# EAGLE design picoamp (EAGLE 5.12)
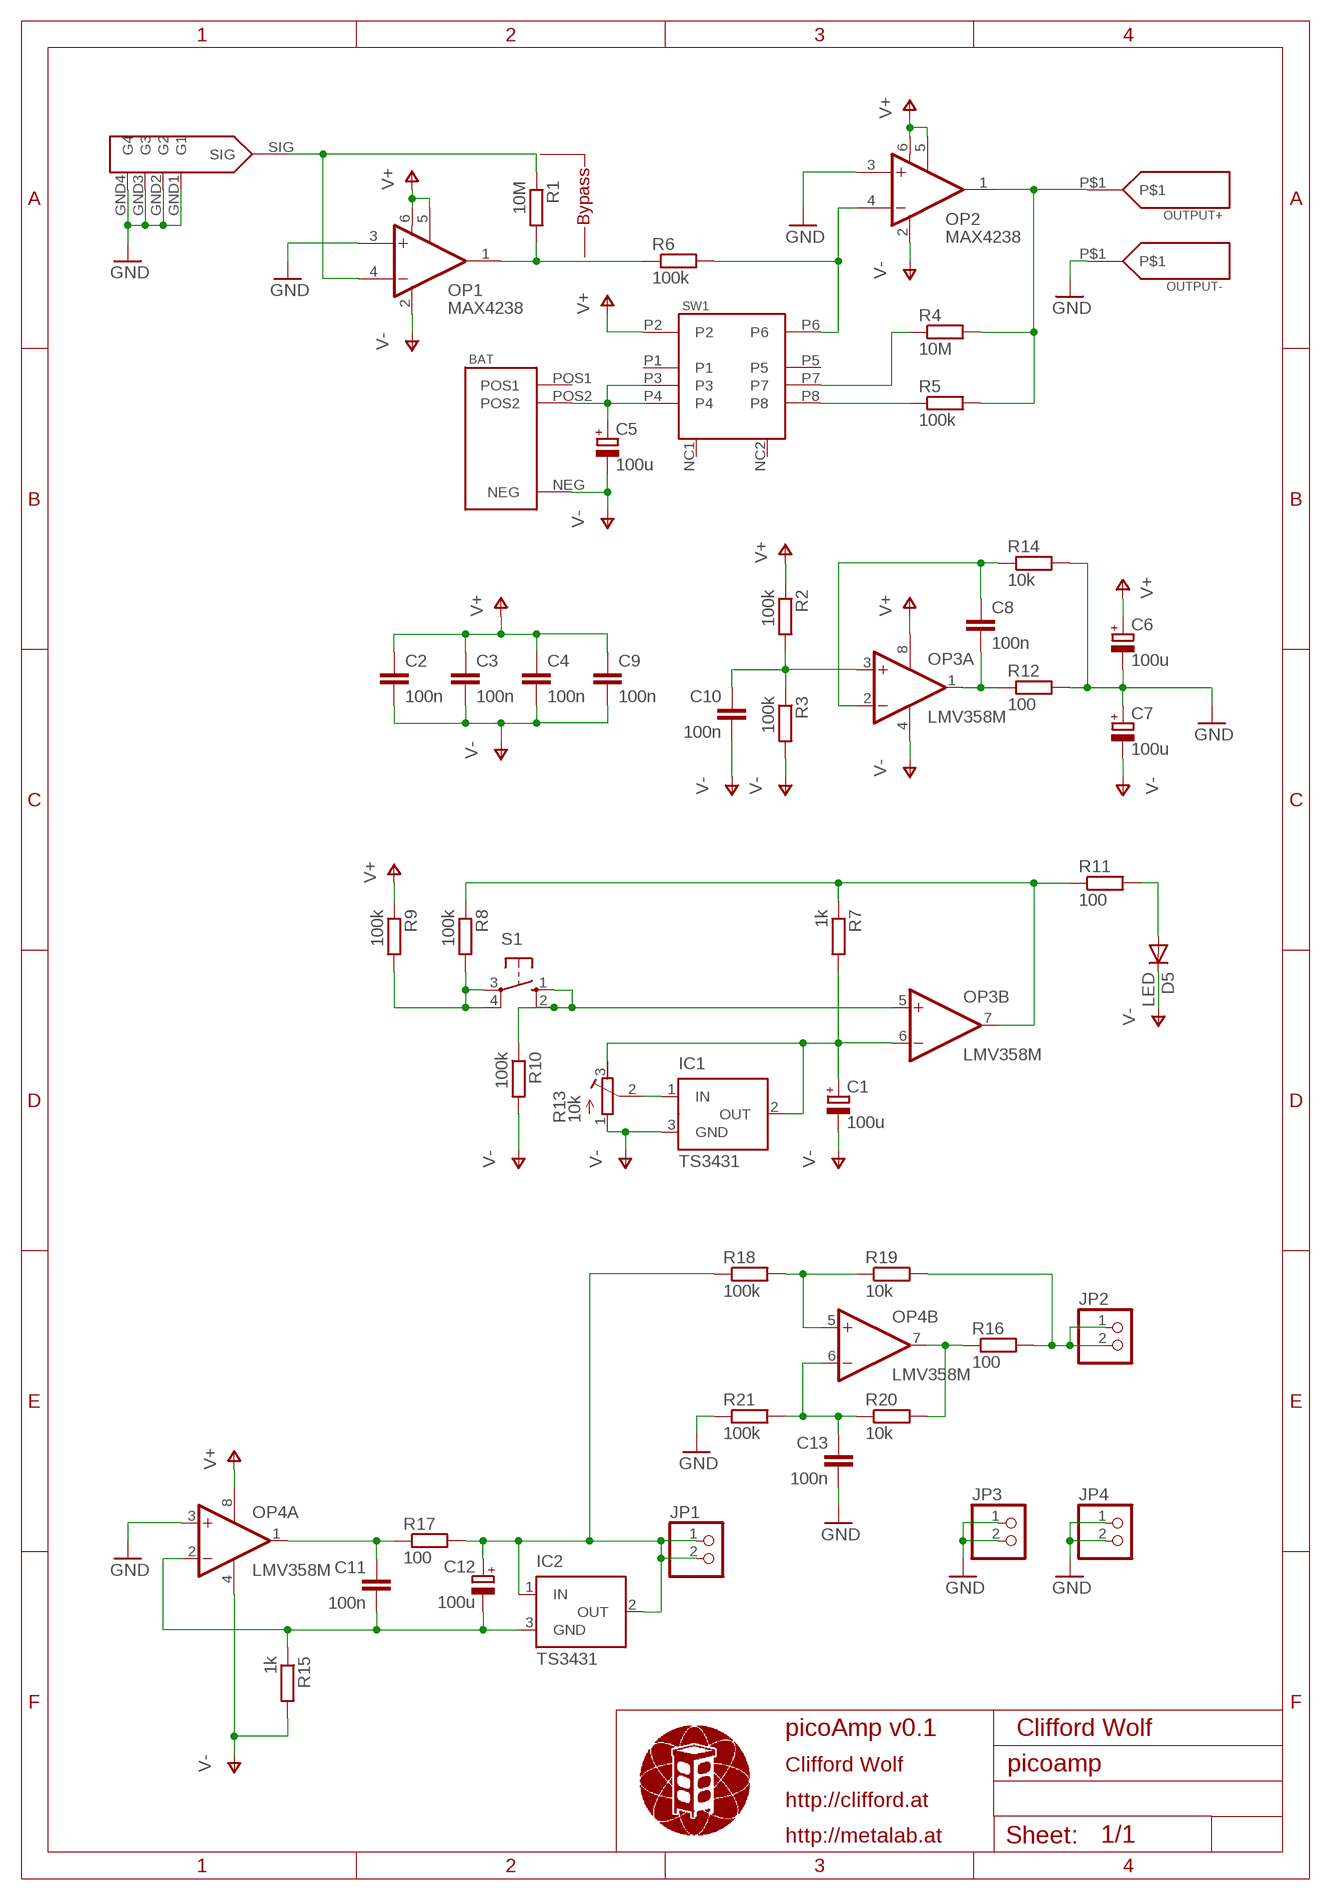
[diagram p0: schematic, sheet 1]

## Parts
BAT  BATCLIP  [BATCLIP]
C1  100u  CPOL-EUA/3216-18R  [A/3216-18R]
C2  100n  C-EUC1206  [C1206]
C3  100n  C-EUC1206  [C1206]
C4  100n  C-EUC1206  [C1206]
C5  100u  CPOL-EUA/3216-18R  [A/3216-18R]
C6  100u  CPOL-EUA/3216-18R  [A/3216-18R]
C7  100u  CPOL-EUA/3216-18R  [A/3216-18R]
C8  100n  C-EUC1206  [C1206]
C9  100n  C-EUC1206  [C1206]
C10  100n  C-EUC1206  [C1206]
C11  100n  C-EUC1206  [C1206]
C12  100u  CPOL-EUA/3216-18R  [A/3216-18R]
C13  100n  C-EUC1206  [C1206]
D5  LED  DIODE-SOD323-W  [SOD323-W]
IC1  TS3431  MAX6520  [SOT23]
IC2  TS3431  MAX6520  [SOT23]
INPUT  BNC  [BNC]
JP1  PINHD-1X2  [1X02]
JP2  PINHD-1X2  [1X02]
JP3  PINHD-1X2  [1X02]
JP4  PINHD-1X2  [1X02]
OP1  MAX4238  [SOT23-6]
OP2  MAX4238  [SOT23-6]
OP3  LMV358M  [SO08]
OP4  LMV358M  [SO08]
OUTPUT+  BANANA  [BANANA]
OUTPUT-  BANANA  [BANANA]
R1  10M  R-EU_R1206W  [R1206W]
R2  100k  R-EU_R1206W  [R1206W]
R3  100k  R-EU_R1206W  [R1206W]
R4  10M  R-EU_R1206W  [R1206W]
R5  100k  R-EU_R1206W  [R1206W]
R6  100k  R-EU_R1206W  [R1206W]
R7  1k  R-EU_R1206W  [R1206W]
R8  100k  R-EU_R1206W  [R1206W]
R9  100k  R-EU_R1206W  [R1206W]
R10  100k  R-EU_R1206W  [R1206W]
R11  100  R-EU_R1206W  [R1206W]
R12  100  R-EU_R1206W  [R1206W]
R13  10k  R-TRIMM3314J  [RTRIM3314J]
R14  10k  R-EU_R1206W  [R1206W]
R15  1k  R-EU_R1206W  [R1206W]
R16  100  R-EU_R1206W  [R1206W]
R17  100  R-EU_R1206W  [R1206W]
R18  100k  R-EU_R1206W  [R1206W]
R19  10k  R-EU_R1206W  [R1206W]
R20  10k  R-EU_R1206W  [R1206W]
R21  100k  R-EU_R1206W  [R1206W]
S1  10-XX  [B3F-10XX]
SW1  SW-2P3T  [SW-2P3T]

## Nets
ASDASD: INPUT.SIG OP1.4(-IN) R1.1
GND: C6.- C7.+ C13.2 INPUT.GND1(G1) INPUT.GND2(G2) INPUT.GND3(G3) INPUT.GND4(G4) JP3.1 JP3.2 JP4.1 JP4.2 OP1.3(+IN) OP2.3(+IN) OP4.3(A:+IN) OUTPUT-.P$1 R12.2 R14.2 R21.1
N$1: OP1.1(OUT) R1.2 R6.1
N$2: C8.1 OP3.2(A:-IN) R14.1
N$3: C10.1 OP3.3(A:+IN) R2.2 R3.1
N$4: BAT.POS2 C5.+ SW1.P3 SW1.P4
N$5: C12.+ IC2.1(IN) IC2.2(OUT) JP1.1 JP1.2 R17.2 R18.1
N$6: R5.1 SW1.P8
N$7: R4.1 SW1.P7
N$8: R8.2 R9.2 S1.3(P) S1.4(P1)
N$9: OP2.4(-IN) R6.2 SW1.P6
N$10: OP2.1(OUT) OUTPUT+.P$1 R4.2 R5.2
N$11: OP3.5(B:+IN) R10.1 S1.1(S) S1.2(S1)
N$12: OP3.7(B:OUT) R7.1 R8.1 R11.1
N$13: D5.A R11.2
N$14: JP2.1 JP2.2 R16.2 R19.2
N$15: OP4.7(B:OUT) R16.1 R20.2
N$16: IC1.1(IN) R13.2(S)
N$17: C1.+ IC1.2(OUT) OP3.6(B:-IN) R7.2 R13.3(A)
N$18: C8.2 OP3.1(A:OUT) R12.1
N$19: C11.1 OP4.1(A:OUT) R17.1
N$20: C11.2 C12.- IC2.3(GND) OP4.2(A:-IN) R15.1
N$21: OP4.5(B:+IN) R18.2 R19.1
N$22: C13.1 OP4.6(B:-IN) R20.1 R21.2
V+: C2.1 C3.1 C4.1 C6.+ C9.1 OP1.5(SHDN) OP1.6(V+) OP2.5(SHDN) OP2.6(V+) OP3.8(P:V+) OP4.8(P:V+) R2.1 R9.1 SW1.P2
V-: BAT.NEG C1.- C2.2 C3.2 C4.2 C5.- C7.- C9.2 C10.2 D5.C IC1.3(GND) OP1.2(V-) OP2.2(V-) OP3.4(P:V-) OP4.4(P:V-) R3.2 R10.2 R13.1(E) R15.2
Unconnected: BAT.POS1 SW1.NC1 SW1.NC2 SW1.P1 SW1.P5

## Notes on the sheet
- Bypass
- picoAmp v0.1 | Clifford Wolf
- Clifford Wolf
- http://clifford.at
- http://metalab.at

## Library data of the parts
BAT = parts:BATCLIP
C1 C5-C7 C12 = resistor:CPOL-EU: POLARIZED CAPACITOR, European symbol
C2-C4 C8-C11 C13 = resistor:C-EU: CAPACITOR, European symbol
D5 = diode:DIODE-: DIODE
IC1 IC2 = maxim:MAX6520: 1.2V Voltage Reference 50ppm/°C, SOT23, 3-Terminal Source: Data sheet <http://datasheets.maxim-ic.com/en/ds/MAX6520.pdf>; MF: MAXIM; MPN: MAX6520EUR-T; OC_FARNELL: unknown; OC_NEWARK: 02J4586
INPUT = parts:BNC
JP1-JP4 = pinhead:PINHD-1X2: PIN HEADER
OP1 OP2 = parts:MAX4238
OP3 OP4 = linear:LMV358?*: Dual General Purpose, Low Voltage, Rail-to-Rail Output Operational Amplifiers Source: http://www.national.com/mpf/LM/LMV321.html http://www.national.com/dt/lmv_qual.pdf
OUTPUT+ OUTPUT- = parts:BANANA
R1-R12 R14-R21 = resistor:R-EU_: RESISTOR, European symbol
R13 = resistor:R-TRIMM: Trimm resistor
S1 = switch-omron:10-XX: OMRON SWITCH; MPN: B3F-1000; OC_FARNELL: 176432; OC_NEWARK: 36M3542
SW1 = parts:SW-2P3T

## Board
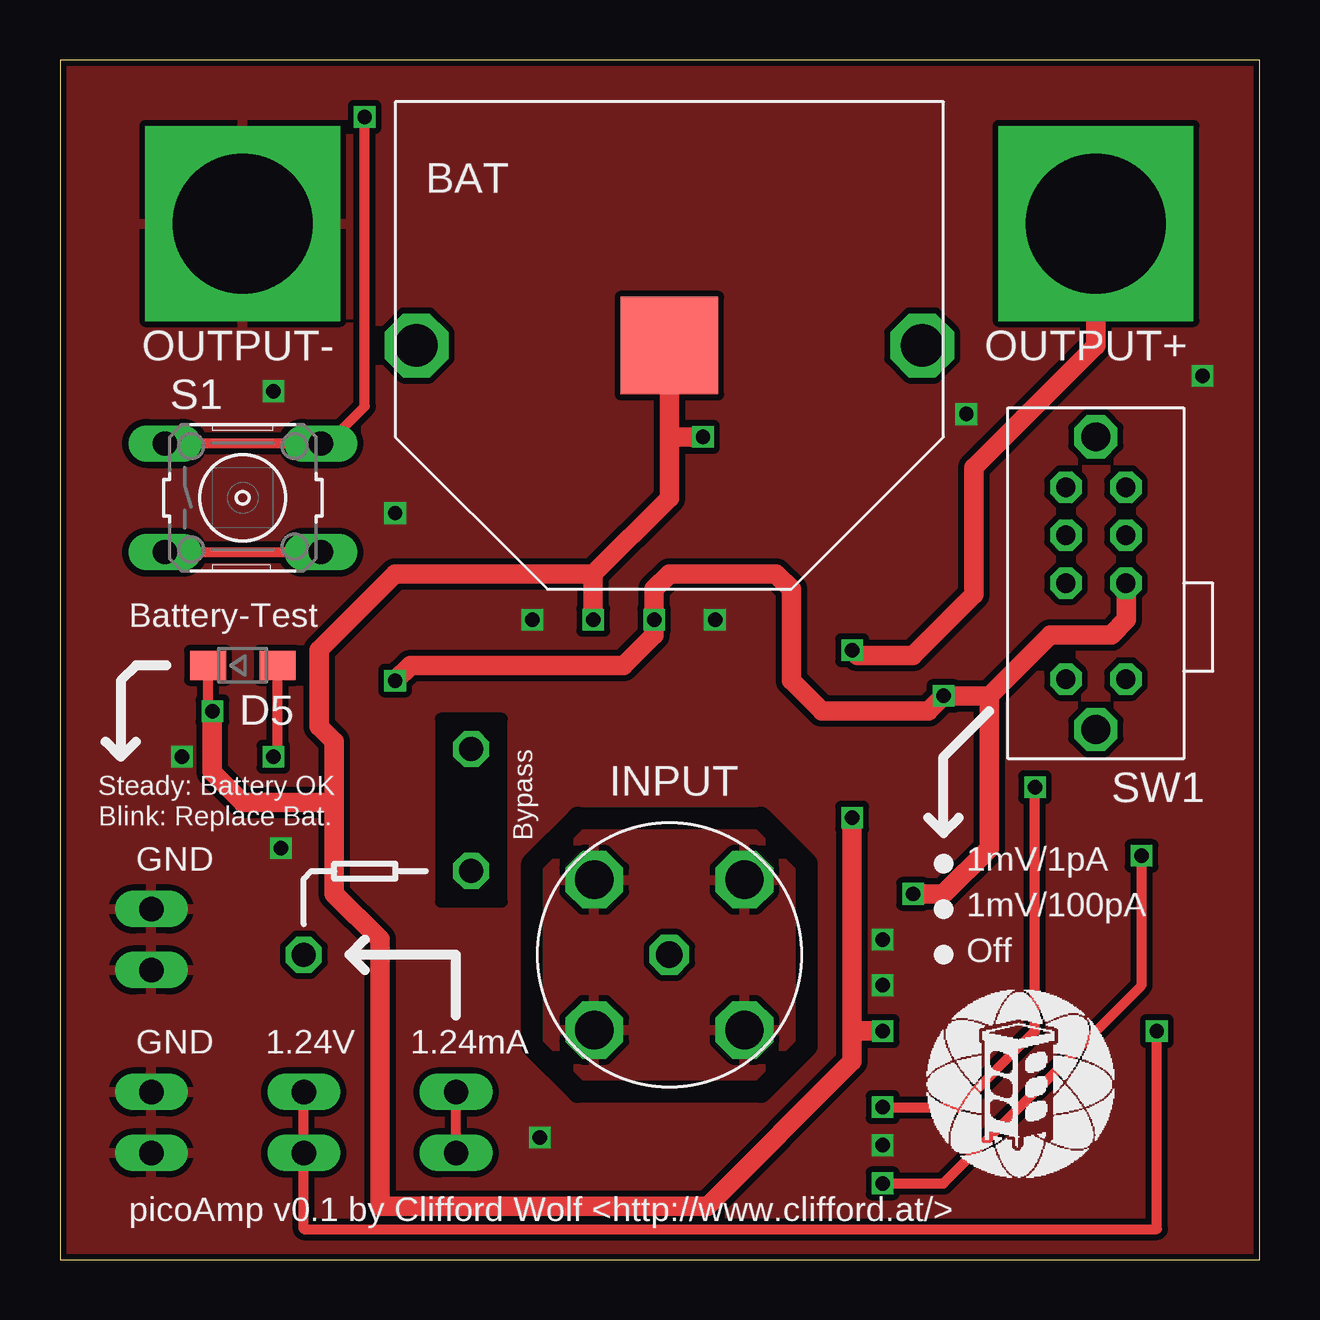
[diagram p1: board, top side]
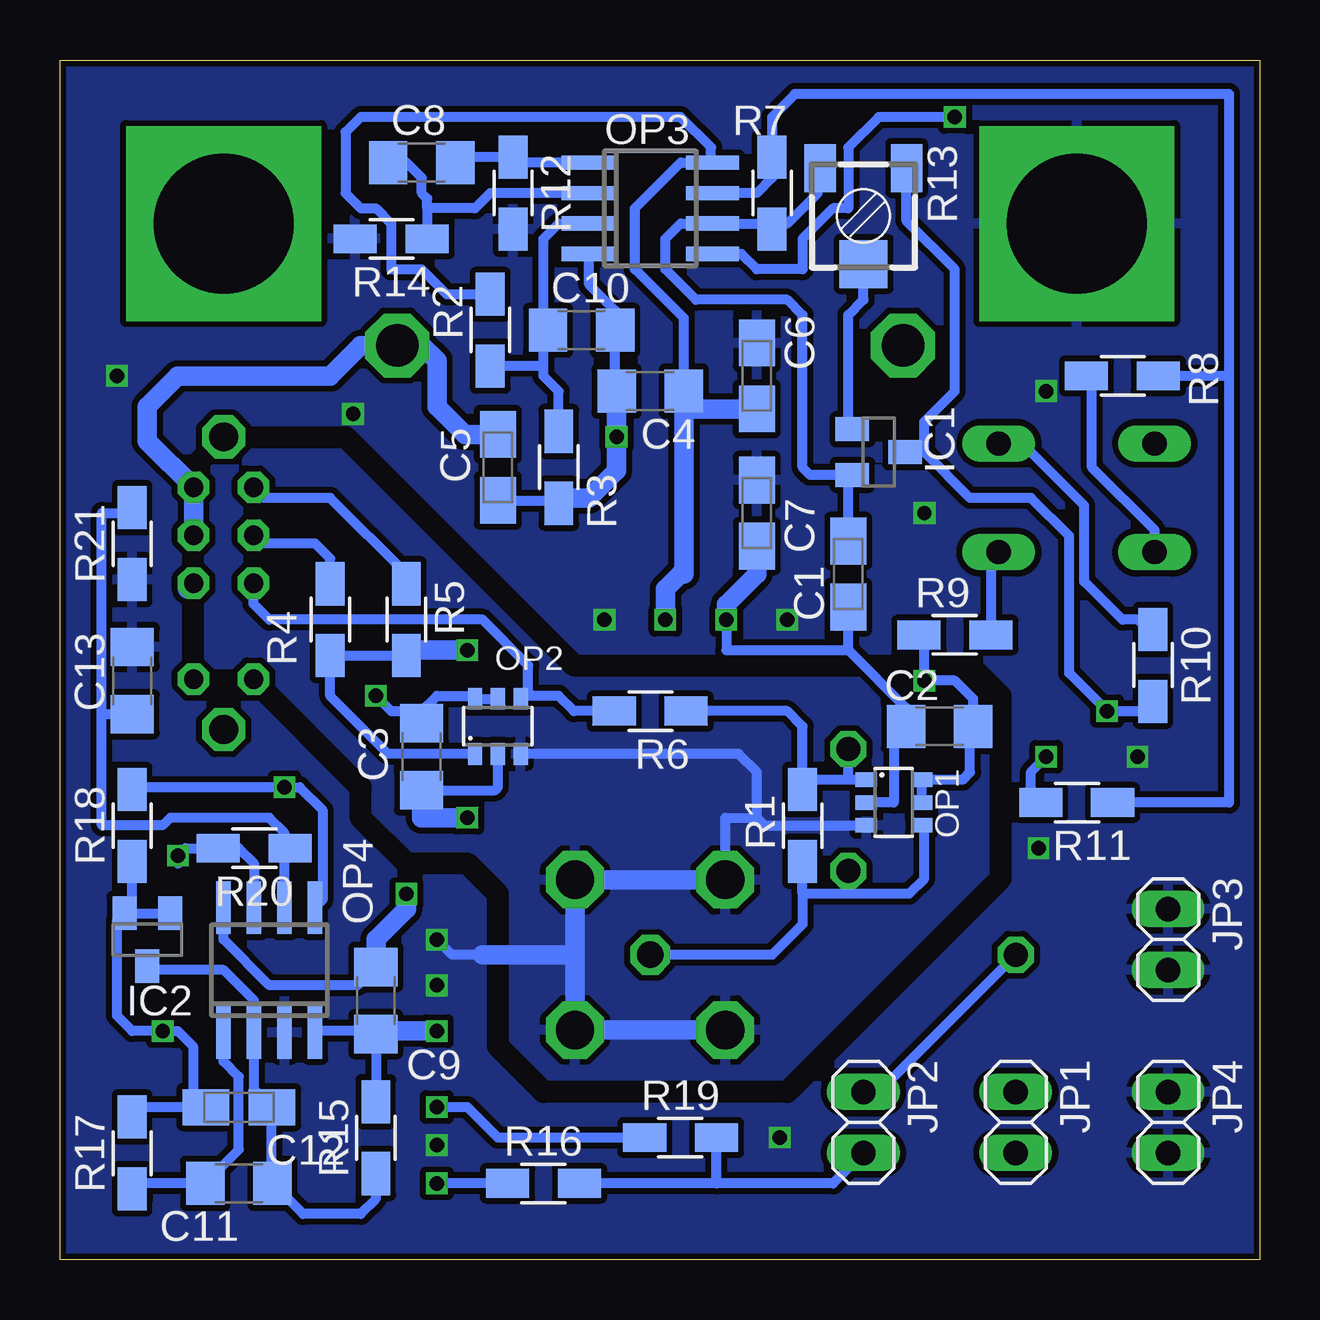
[diagram p2: board, bottom side, seen from below]

Size 50 x 50 mm. Coordinates in mm from the lower left corner, seen from the top.
Outline: 0,0 50,0 50,50 0,50 0,0
Copper layers (1*16): Top 0.035mm / dielectric 1.5mm / Bottom 0.035mm
Design rules "seeed *": minimum track width 6mil, minimum drill 12mil, track to track 6mil, track to pad 6mil, pad to pad 6mil, via to via 6mil, smd to smd 0mil, copper to edge 10mil, drill to drill 10mil, minimum pad ring 10mil, minimum via ring 6mil, stop-mask expansion 2mil, vias tented up to drill 100mil, thermal gap 10mil
tRestrict: area 15.9,14.9 to 18.4,22.5; 8 lines
bRestrict: 17 lines

### Footprints (pad centres in the part's own frame; a part is rotated, then mirrored left to right if it is on the bottom)
BATCLIP = smd 4.064 x 4.064: NEG 0,0 | drill 1.778 octagon: POS1 -10.541,0; POS2 10.541,0
A/3216-18R = smd 1.95 x 1.5: + 1.375,0; - -1.375,0
C1206 = smd 1.6 x 1.8: 1 -1.4,0; 2 1.4,0
SOD323-W = smd 1.5 x 1.2: A 1.45,0; C -1.45,0
SOT23 = smd 1 x 1.4: 1 -0.95,-1.1; 2 0.95,-1.1; 3 0,1.1
BNC = drill 1.6 octagon: GND1 -3.13,3.13; GND2 3.13,3.13; GND3 -3.13,-3.13; GND4 3.13,-3.13 | drill 1.1 octagon: SIG 0,0
1X02 = drill 1.016 long: 1 -1.27,0; 2 1.27,0
SOT23-6 = smd 0.6 x 0.9: 1 -0.95,-1.15; 2 0,-1.15; 3 0.95,-1.15; 4 0.95,1.15; 5 0,1.15; 6 -0.95,1.15
SO08 = smd 0.6 x 2.2: 1 -1.905,-2.6; 2 -0.635,-2.6; 3 0.635,-2.6; 4 1.905,-2.6; 5 1.905,2.6; 6 0.635,2.6; 7 -0.635,2.6; 8 -1.905,2.6
BANANA = drill 5.842 pad 8.128 square: P$1 0,0
R1206W = smd 1.8 x 1.2: 1 -1.499,0; 2 1.499,0
RTRIM3314J = smd 1.3 x 2: 1 -1.8,-2; 3 1.8,-2 | smd 2 x 2: 2 0,2
B3F-10XX = drill 1.016 long: 1 -3.251,2.261; 2 3.251,2.261; 3 -3.251,-2.261; 4 3.251,-2.261
SW-2P3T = drill 1.2 octagon: NC1 0,0; NC2 -12.2,0 | drill 0.8 octagon: P1 -10.1,-1.25; P2 -6.1,-1.25; P3 -4.1,-1.25; P4 -2.1,-1.25; P5 -10.1,1.25; P6 -6.1,1.25; P7 -4.1,1.25; P8 -2.1,1.25

### Placement (x,y rotation side)
BAT  25.4,38.1 0 top
C1  17.14,28.57 90 bottom
C2  13.34,22.23 180 bottom
C3  34.92,20.95 270 bottom
C4  25.4,36.2 180 bottom
C5  31.75,33.02 90 bottom
C6  20.95,36.83 270 bottom
C7  20.95,31.11 90 bottom
C8  34.92,45.72 0 bottom
C9  36.83,10.79 270 bottom
C10  28.26,38.73 0 bottom
C11  42.55,3.17 0 bottom
C12  42.55,6.35 180 bottom
C13  46.99,24.13 90 bottom
D5  7.62,24.77 0 top
IC1  15.88,33.66 270 bottom
IC2  46.35,13.34 180 bottom
INPUT  25.4,12.7 0 top
JP1  10.16,5.71 270 bottom
JP2  16.51,5.71 270 bottom
JP3  3.81,13.34 270 bottom
JP4  3.81,5.71 270 bottom
OP1  15.24,19.05 270 bottom
OP2  31.75,22.23 0 bottom
OP3  25.4,43.81 270 bottom
OP4  41.27,12.06 0 bottom
OUTPUT+  43.18,43.18 180 top
OUTPUT-  7.62,43.18 180 top
R1  19.05,18.1 90 bottom
R2  32.07,38.73 270 bottom
R3  29.21,33.02 270 bottom
R4  38.73,26.67 270 bottom
R5  35.56,26.67 270 bottom
R6  25.4,22.86 180 bottom
R7  20.32,44.45 270 bottom
R8  5.71,36.83 180 bottom
R9  12.7,26.04 0 bottom
R10  4.45,24.77 270 bottom
R11  7.62,19.05 180 bottom
R12  31.11,44.45 270 bottom
R13  16.51,43.5 180 bottom
R14  36.2,42.55 180 bottom
R15  36.83,5.08 90 bottom
R16  29.84,3.17 0 bottom
R17  46.99,4.45 90 bottom
R18  46.99,18.1 90 bottom
R19  24.13,5.08 0 bottom
R20  41.91,17.14 180 bottom
R21  46.99,29.84 90 bottom
S1  7.62,31.75 0 top
SW1  43.18,34.29 90 top
U$1  [METALAB_MEDIUM]  40.01,7.3 0 top

### Tracks (layer width: path | path; a pad name or v marks a point on that pad's centre or on a via)
ASDASD  (via drill 1)
  Bottom 0.406: INPUT.SIG 20.32,12.7 19.05,13.97 19.05,15.24 | 19.05,15.24 R1.1 | 17.14,15.24 19.05,15.24 | 17.14,15.24 v17.14,16.19 | OP1.4 13.97,17.98 13.97,15.88 14.61,15.24 17.14,15.24
GND  (via drill 0.6)
  Bottom 0.406: OP2.3 21.71,21.07 20.95,20.32 20.95,18.41 | 32.38,12.7 33.66,12.7 v34.29,13.34 | OP1.3 20.64,18.1 20.95,18.41 | 20.95,18.41 22.27,18.41 INPUT.GND1
  Bottom 0.813: INPUT.GND3 INPUT.GND4 28.53,12.7 | 28.53,12.7 INPUT.GND2 INPUT.GND1 | 28.53,12.7 32.38,12.7
  other vias: 47.62,36.83 9.21,17.14 37.78,35.24 5.08,20.95 8.89,36.2 19.68,26.67 34.29,11.43 27.3,26.67 20,5.08 34.29,4.76 13.97,31.11
  pour Bottom (isolate 0.254): 0,50.16 50.16,50.16 50.16,0 0,0
  pour Top (isolate 0.254): 0,50.16 50.16,50.16 50.16,0 0,0
N$1  (via drill 1)
  Bottom 0.406: OP1.1 17.14,20 | 17.14,20 18.65,20 R1.2 19.05,22.23 19.68,22.86 R6.1 | 17.14,20 v17.14,21.27
N$2
  Bottom 0.406: 34.7,43.81 R14.1 | 34.7,43.81 34.7,44.22 34.92,44.45 34.92,45.09 35.56,45.72 C8.1 | OP3.2 32.07,44.45 32.7,43.81 34.7,43.81
N$3
  Bottom 0.406: OP3.3 29.21,43.18 29.84,42.55 29.84,38.92 C10.1 29.84,38.55 29.84,37.24 | 29.84,37.24 29.84,36.83 29.21,36.2 R3.1 | 29.84,37.24 R2.2
N$4
  Bottom 0.813: SW1.P3 SW1.P4 46.35,34.12 46.35,35.56 45.09,36.83 38.73,36.83 37.47,38.1 BAT.POS2 34.92,38.1 34.29,37.47 34.29,35.56 33.12,34.4 C5.+
N$5  (via drill 0.6)
  Top 0.406: v45.72,9.53 45.72,1.27 10.16,1.27 JP1.2 JP1.1
  Bottom 0.406: C12.+ 46.58,6.35 | 46.58,6.35 R17.2 | 46.58,6.35 46.99,6.35 | C12.+ 45.09,6.35 | IC2.2 IC2.1 | R18.1 46.99,14.75 IC2.2 | IC2.2 47.62,14.12 47.62,10.16 46.99,9.53 v45.72,9.53 45.09,9.53 44.45,8.89 44.45,6.88 C12.+
N$6
  Bottom 0.406: R5.1 35.56,28.57 38.73,31.75 41.49,31.75 SW1.P8
N$7
  Bottom 0.406: R4.1 38.73,29.21 39.37,29.84 41.59,29.84 SW1.P7
N$8
  Top 0.406: S1.3 S1.4
  Bottom 0.406: R9.2 11.2,29.16 S1.4 | S1.3 4.37,30.4 6.99,33.02 6.99,36.6 R8.2
N$9
  Bottom 0.406: R6.2 28.57,22.86 29.21,23.5 30.68,23.5 OP2.4 30.48,23.7 30.48,24.77 32.38,26.67 41.27,26.67 41.93,27.32 SW1.P6
N$10  (via drill 0.6)
  Top 0.813: OUTPUT+.P$1 43.18,38.1 38.1,33.02 38.1,27.71 R5.2 33.25,25.17 v33.02,25.4
  Bottom 0.406: R5.2 R4.2 38.73,23.5 36.31,21.07 OP2.1
  Bottom 0.813: v33.02,25.4 35.33,25.4 R5.2
N$11  (via drill 0.6)
  Top 0.406: S1.1 S1.2 11.15,34.01 12.7,35.56 v12.7,47.62
  Bottom 0.406: R10.1 4.67,26.26 5.08,26.67 5.71,26.67 7.3,28.26 7.3,31.43 9.88,34.01 S1.2 | OP3.5 21.59,41.91 20.95,41.27 19.05,41.27 19.05,42.55 17.78,43.81 17.14,43.81 17.14,46.35 15.88,47.62 v12.7,47.62
N$12
  Bottom 0.406: 4.45,36.83 R8.1 1.27,36.83 | 1.27,36.83 1.27,48.58 19.37,48.58 20.32,47.62 R7.1 20.32,45.09 20.95,44.45 OP3.7 | 1.27,36.83 1.27,19.05 R11.1
N$13  (via drill 0.6)
  Top 0.406: D5.A 9.07,21.14 v8.89,20.95
  Bottom 0.406: R11.2 9.53,19.46 9.53,20.32 v8.89,20.95
N$14  (via drill 1)
  Top 0.406: JP2.2 JP2.1
  Bottom 0.406: JP2.1 15.88,6.99 v10.16,12.7 | 22.63,3.17 17.78,3.17 JP2.2 | 22.63,3.17 R19.2 | 22.63,3.17 R16.2
N$15  (via drill 0.6)
  Top 0.406: v34.29,3.17 36.83,3.17 45.09,11.43 v45.09,16.83
  Bottom 0.406: OP4.7 41.91,16.51 42.55,17.14 R20.2 44.77,17.14 v45.09,16.83 45.09,16.51 | R16.1 v34.29,3.17
N$16
  Bottom 0.406: R13.2 16.51,40.01 17.14,39.37 17.14,34.77 IC1.1
N$17
  Bottom 0.406: C1.+ 17.14,32.53 IC1.2 18.73,32.7 19.05,33.02 19.05,39.37 19.68,40.01 23.5,40.01 24.77,41.27 24.77,42.55 24.13,43.18 OP3.6 20.55,43.18 R7.2 20.09,43.18 19.68,43.18 18.41,44.45 18.41,45.39 R13.3
N$18
  Bottom 0.406: 33.3,45.49 C8.2 33.3,45.95 R12.1 30.89,45.72 OP3.1
N$19
  Bottom 0.406: 46.58,2.54 R17.1 46.76,3.17 C11.1 42.55,4.58 42.55,7.62 43.18,8.26 OP4.1
N$20
  Bottom 0.406: R15.1 36.83,2.54 37.47,1.91 39.88,1.91 C11.2 41.17,3.2 C12.- 41.91,7.09 OP4.2 41.91,10.79 43.18,12.06 46.19,12.06 IC2.3
N$21  (via drill 0.6)
  Top 0.406: v34.29,6.35 37.47,6.35 40.64,9.53 v40.64,19.68
  Bottom 0.406: OP4.5 39.05,14.98 39.05,18.73 40.01,19.68 v40.64,19.68 46.9,19.68 R18.2 | R19.1 31.75,5.08 33.02,6.35 v34.29,6.35
N$22
  Bottom 0.406: OP4.6 40.64,16.92 | 40.64,16.92 R20.1 | R21.2 47.22,31.11 48.26,31.11 48.26,22.86 | 40.64,16.92 40.64,17.78 41.27,18.41 45.4,18.41 45.72,18.1 48.26,18.1 48.26,22.86 | C13.1 48.13,22.73 48.26,22.86
V+  (via drill 0.6)
  Top 0.813: 38.73,23.5 41.27,26.04 43.81,26.04 44.45,26.67 44.45,28.17 SW1.P2 | v13.97,24.13 14.61,24.77 23.5,24.77 24.77,26.04 v24.77,26.67 24.77,27.94 25.4,28.57 29.84,28.57 30.48,27.94 30.48,24.13 31.75,22.86 36.2,22.86 v36.83,23.5 38.73,23.5 | v35.56,15.24 36.83,15.24 38.73,17.14 38.73,23.5
  Bottom 0.406: OP1.5 OP1.6 12.38,20 12.06,20.32 12.06,22.09 C2.1 11.94,23.36 12.7,24.13 v13.97,24.13 13.97,25.81 R9.1 | 34.92,22.86 C3.1 | 34.92,22.86 34.29,23.5 32.82,23.5 OP2.6 OP2.5 | 34.92,22.86 36.2,22.86 v36.83,23.5 | R2.1 33.88,40.23 34.92,41.27 36.2,41.27 36.2,43.18 36.83,43.81 37.47,43.81 38.1,44.45 38.1,46.99 37.47,47.62 24.13,47.62 22.86,46.35 22.86,45.78 OP3.8 24.13,45.72 26.04,43.81 26.04,41.27 24,39.24 C4.1 | OP4.8 43.18,13.34 41.27,11.43 37.59,11.43 C9.1
  Bottom 0.813: SW1.P2 44.68,27.94 | v24.77,26.67 24.77,27.94 24.13,28.57 24,28.57 24,35.45 | v35.56,15.24 35.56,14.61 36.83,13.34 C9.1 | 24,35.45 C6.+ | 24,35.45 C4.1
V-  (via drill 0.6)
  Top 0.406: D5.C 6.17,23.04 v6.35,22.86
  Top 0.813: 25.4,34.29 25.4,31.75 22.23,28.57 | 22.23,28.57 13.97,28.57 10.79,25.4 10.79,22.23 11.43,21.59 11.43,19.05 | v6.35,22.86 6.35,20.32 7.62,19.05 11.43,19.05 | 22.23,28.57 v22.23,26.67 | 25.4,34.29 BAT.NEG | 25.4,34.29 v26.8,34.29 | 33.02,9.53 v34.29,9.53 | 33.02,9.53 v33.02,18.41 | 11.43,19.05 11.43,15.24 13.34,13.34 13.34,2.22 26.99,2.22 33.02,8.26 33.02,9.53
  Bottom 0.406: OP1.2 15.24,19.05 15.24,22.23 C2.2 14.73,22.99 17.14,25.4 | OP2.2 31.75,19.68 31.88,19.55 C3.2 | R10.2 4.85,22.86 v6.35,22.86 7.94,24.45 7.94,30.16 9.53,31.75 12.06,31.75 13.97,33.66 | R13.1 14.71,43.28 12.7,41.27 12.7,36.2 13.97,34.92 13.97,33.66 | 13.97,33.66 IC1.3 | 17.14,25.4 C1.- 17.14,27.3 | 17.14,25.4 22.23,25.4 v22.23,26.67 | C4.2 26.86,36.25 C10.2 26.86,39.56 27.94,40.64 27.94,41.85 OP3.4 | OP4.4 39.31,9.53 36.96,9.53 C9.2 R15.2 | 29.31,31.62 31.75,31.62 C5.-
  Bottom 0.813: C3.2 34.92,18.41 v33.02,18.41 | 29.31,31.62 R3.2 28.98,31.75 27.94,31.75 26.8,32.89 v26.8,34.29 C4.2 | v22.23,26.67 22.23,27.3 20.95,28.57 C7.- | v34.29,9.53 36.96,9.53

### Text on the board
tPlace: Battery-Test | Steady: Battery OK | Blink: Replace Bat. | Bypass | GND | 1mV/1pA | 1mV/100pA | Off | GND | 1.24V | 1.24mA | picoAmp v0.1 by Clifford Wolf <http://www.clifford.at/>